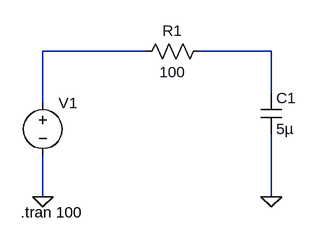
[diagram p0: schematic Draft2.asc]
Draft2.asc, the LTspice schematic file:
Version 4
SHEET 1 880 680
WIRE 512 112 352 112
WIRE 704 112 592 112
WIRE 704 176 704 112
WIRE 352 192 352 112
WIRE 352 336 352 272
WIRE 704 336 704 240
FLAG 352 336 0
FLAG 704 336 0
SYMBOL voltage 352 176 R0
WINDOW 3 24 96 Invisible 2
WINDOW 123 0 0 Left 0
WINDOW 39 0 0 Left 0
SYMATTR InstName V1
SYMATTR Value PULSE(0 5 0 0 0 5m 10m)
SYMBOL res 608 96 R90
WINDOW 0 0 56 VBottom 2
WINDOW 3 32 56 VTop 2
SYMATTR InstName R1
SYMATTR Value 100
SYMBOL cap 688 176 R0
SYMATTR InstName C1
SYMATTR Value 5µ
TEXT 318 360 Left 2 !.tran 100

The netlist it stands for:
* Draft2.asc
V1 N001 0 PULSE(0 5 0 0 0 5m 10m)
R1 N002 N001 100
C1 N002 0 5µ
.tran 100
.backanno
.end